# EAGLE schematic VGA Blinken (EAGLE 7.2.0)
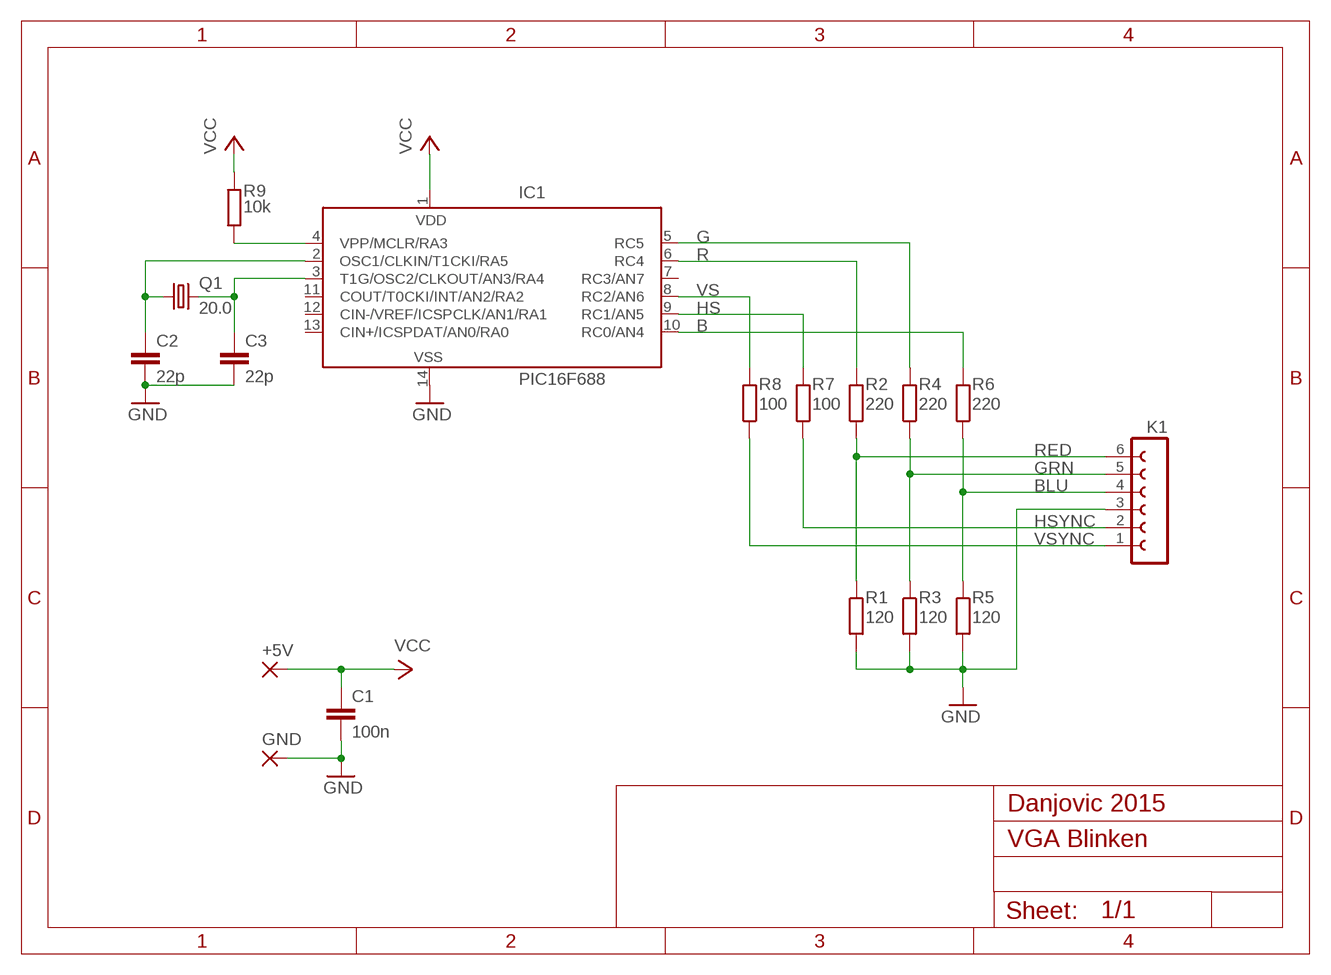
[diagram p0: schematic, sheet 1]

## Parts
+5V  1,6/0,8  [1,6/0,8]
C1  100n  C-EU  [C025-024X044L]
C2  22p  C-EU  [C025-024X044L]
C3  22p  C-EU  [C025-024X044L]
GND  1,6/0,8  [1,6/0,8]
IC1  PIC16F688  PIC16F676P  [DIL14]
K1  FE06-1  [FE06]
Q1  20.0  CRYSTALHC49S  [HC49/S]
R1  120  R-EU_0204/2VL  [0204VL]
R2  220  R-EU_0204/2VL  [0204VL]
R3  120  R-EU_0204/2VL  [0204VL]
R4  220  R-EU_0204/2VL  [0204VL]
R5  120  R-EU_0204/2VL  [0204VL]
R6  220  R-EU_0204/2VL  [0204VL]
R7  100  R-EU_0204/2VL  [0204VL]
R8  100  R-EU_0204/2VL  [0204VL]
R9  10k  R-EU_0204/2VL  [0204VL]

## Nets
B: IC1.10(RC0/AN4) R6.2
BLU: K1.4 R5.1 R6.1
G: IC1.5(RC5) R4.2
GND: C1.2 C2.2 C3.2 GND.1(P) IC1.14(VSS) K1.3 R1.2 R3.2 R5.2
GRN: K1.5 R3.1 R4.1
HS: IC1.9(RC1/AN5) R7.2
HSYNC: K1.2 R7.1
R: IC1.6(RC4) R2.2
RED: K1.6 R1.1 R2.1
RST: IC1.4(VPP/MCLR/RA3) R9.2
VCC: +5V.1(P) C1.1 IC1.1(VDD) R9.1
VS: IC1.8(RC2/AN6) R8.2
VSYNC: K1.1 R8.1
X1: C2.1 IC1.2(OSC1/CLKIN/T1CKI/RA5) Q1.1
X2: C3.1 IC1.3(T1G/OSC2/CLKOUT/AN3/RA4) Q1.2
Unconnected: IC1.7(RC3/AN7) IC1.11(COUT/T0CKI/INT/AN2/RA2) IC1.12(CIN-/VREF/ICSPCLK/AN1/RA1) IC1.13(CIN+/ICSPDAT/AN0/RA0)

## Notes on the sheet
- Danjovic 2015

## Library data of the parts
+5V GND = wirepad:1,6/0,8: THROUGH-HOLE PAD
C1-C3 = rcl:C-EU: CAPACITOR, European symbol
IC1 = microchip:PIC16F676: 14-Pin, Flash-Based 8-Bit CMOS Microcontroller High Performance RISC CPU: * Only 35 instructions to learn - All single-cycle instructions except branches * Operating speed: - DC - 20 MHz oscillator/clock input - DC - 200 ns instruction cycle * Internal and external oscillator options - Precision Internal 4 MHz oscillator factory calibrated to ±1% - External Oscillator support for crystals and resonators - 5?s wake-up from SLEEP, 3.0V, typical * Power saving SLEEP mode * Wide operating voltage range - 2.0V to 5.5V * Industrial and Extended temperature range * Low power Power-on Reset (POR) * Power-up Timer (PWRT) and Oscillator Start-up Timer (OST) * Brown-out Detect (BOD) * Watchdog Timer (WDT) with independent oscillator for reliable operation * Multiplexed MCLR/Input-pin * Interrupt-on-pin change * Individual programmable weak pull-ups * Programmable code protection * High Endurance FLASH/EEPROM Cell - 100,000 write FLASH endurance - 1,000,000 write EEPROM endurance - FLASH/Data EEPROM Retention: > 40 years * Standby Current: - 1 nA @ 2.0V, typical * Operating Current: - 8.5?A @ 32 kHz, 2.0V, typical - 100?A @ 1 MHz, 2.0V, typical * Watchdog Timer Current - 300 nA @ 2.0V, typical * Timer1 oscillator current: - 4?A @ 32 kHz, 2.0V, typical * 12 I/O pins with individual direction control * High current sink/source for direct LED drive * Analog-to-Digital Converter module (PIC16F676): - 10-bit resolution - Programmable 8-channel input - Voltage reference input * In-Circuit Serial ProgrammingTM (ICSPTM) via two pins Source: http://ww1.microchip.com/downloads/en/DeviceDoc/40039E.pdf; MF: MICROCHIP; MPN: PIC16F676-I/P; OC_FARNELL: 9760512; OC_NEWARK: 54K2829
K1 = con-lsta:FE06-1: FEMALE HEADER; OC_FARNELL: unknown; OC_NEWARK: unknown
Q1 = crystal:CRYSTAL: CRYSTAL; OC_FARNELL: 1667008; OC_NEWARK: unknown
R1-R9 = rcl:R-EU_: RESISTOR, European symbol